# EAGLE design main (EAGLE 9.0.1)
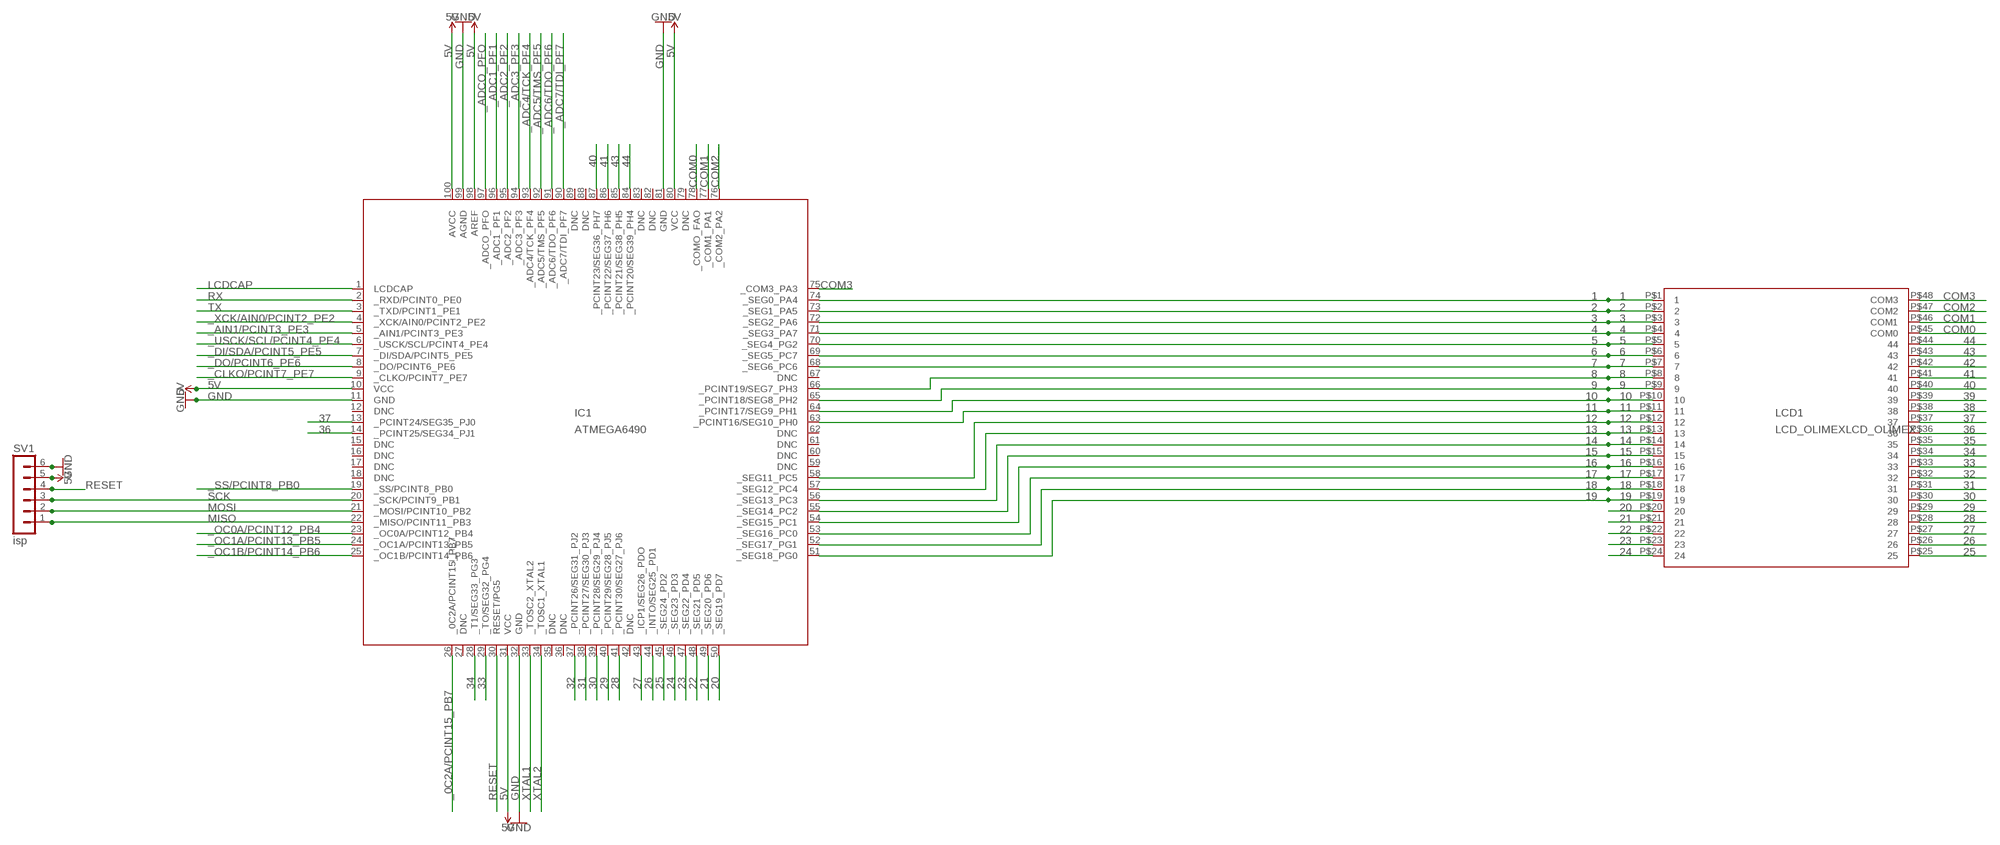
[diagram p0: schematic, sheet 1]

## Parts
IC1  ATMEGA6490  [TQFP100]
LCD1  LCD_OLIMEXLCD_OLIMEX  [LCD_OLIMEX]
SV1  isp  MA06-1  [MA06-1]

## Nets
1: IC1.74(_SEG0_PA4) LCD1.P$1
2: IC1.73(_SEG1_PA5) LCD1.P$2
3: IC1.72(_SEG2_PA6) LCD1.P$3
4: IC1.71(_SEG3_PA7) LCD1.P$4
5: IC1.70(_SEG4_PG2) LCD1.P$5
5V: IC1.10(VCC) IC1.31(VCC) IC1.80(VCC) IC1.98(AREF) IC1.100(AVCC) SV1.5
6: IC1.69(_SEG5_PC7) LCD1.P$6
7: IC1.68(_SEG6_PC6) LCD1.P$7
8: IC1.66(_PCINT19/SEG7_PH3) LCD1.P$8
9: IC1.65(_PCINT18/SEG8_PH2) LCD1.P$9
10: IC1.64(_PCINT17/SEG9_PH1) LCD1.P$10
11: IC1.63(_PCINT16/SEG10_PH0) LCD1.P$11
12: IC1.58(_SEG11_PC5) LCD1.P$12
13: IC1.57(_SEG12_PC4) LCD1.P$13
14: IC1.56(_SEG13_PC3) LCD1.P$14
15: IC1.55(_SEG14_PC2) LCD1.P$15
16: IC1.54(_SEG15_PC1) LCD1.P$16
17: IC1.53(_SEG16_PC0) LCD1.P$17
18: IC1.52(_SEG17_PG1) LCD1.P$18
19: IC1.51(_SEG18_PG0) LCD1.P$19
20: IC1.50(_SEG19_PD7) LCD1.P$20
21: IC1.49(_SEG20_PD6) LCD1.P$21
22: IC1.48(_SEG21_PD5) LCD1.P$22
23: IC1.47(_SEG22_PD4) LCD1.P$23
24: IC1.46(_SEG23_PD3) LCD1.P$24
25: IC1.45(_SEG24_PD2) LCD1.P$25
26: IC1.44(_INTO/SEG25_PD1) LCD1.P$26
27: IC1.43(_ICP1/SEG26_PDO) LCD1.P$27
28: IC1.41(_PCINT30/SEG27_PJ6) LCD1.P$28
29: IC1.40(_PCINT29/SEG28_PJ5) LCD1.P$29
30: IC1.39(_PCINT28/SEG29_PJ4) LCD1.P$30
31: IC1.38(_PCINT27/SEG30_PJ3) LCD1.P$31
32: IC1.37(_PCINT26/SEG31_PJ2) LCD1.P$32
33: IC1.29(_TO/SEG32_PG4) LCD1.P$33
34: IC1.28(_T1/SEG33_PG3) LCD1.P$34
35: LCD1.P$35
36: IC1.14(_PCINT25/SEG34_PJ1) LCD1.P$36
37: IC1.13(_PCINT24/SEG35_PJ0) LCD1.P$37
38: LCD1.P$38
39: LCD1.P$39
40: IC1.87(_PCINT23/SEG36_PH7) LCD1.P$40
41: IC1.86(_PCINT22/SEG37_PH6) LCD1.P$41
42: LCD1.P$42
43: IC1.85(_PCINT21/SEG38_PH5) LCD1.P$43
44: IC1.84(_PCINT20/SEG39_PH4) LCD1.P$44
_0C2A/PCINT15_PB7: IC1.26(_0C2A/PCINT15_PB7)
_ADC1_PF1: IC1.96(_ADC1_PF1)
_ADC2_PF2: IC1.95(_ADC2_PF2)
_ADC3_PF3: IC1.94(_ADC3_PF3)
_ADC4/TCK_PF4: IC1.93(_ADC4/TCK_PF4)
_ADC5/TMS_PF5: IC1.92(_ADC5/TMS_PF5)
_ADC6/TDO_PF6: IC1.91(_ADC6/TDO_PF6)
_ADC7/TDI_PF7: IC1.90(_ADC7/TDI_PF7)
_ADCO_PFO: IC1.97(_ADCO_PFO)
_AIN1/PCINT3_PE3: IC1.5(_AIN1/PCINT3_PE3)
_CLKO/PCINT7_PE7: IC1.9(_CLKO/PCINT7_PE7)
_DI/SDA/PCINT5_PE5: IC1.7(_DI/SDA/PCINT5_PE5)
_DO/PCINT6_PE6: IC1.8(_DO/PCINT6_PE6)
_OC0A/PCINT12_PB4: IC1.23(_OC0A/PCINT12_PB4)
_OC1A/PCINT13_PB5: IC1.24(_OC1A/PCINT13_PB5)
_OC1B/PCINT14_PB6: IC1.25(_OC1B/PCINT14_PB6)
_SS/PCINT8_PB0: IC1.19(_SS/PCINT8_PB0)
_USCK/SCL/PCINT4_PE4: IC1.6(_USCK/SCL/PCINT4_PE4)
_XCK/AIN0/PCINT2_PE2: IC1.4(_XCK/AIN0/PCINT2_PE2)
COM0: IC1.78(_COMO_FAO) LCD1.P$45(COM0)
COM1: IC1.77(_COM1_PA1) LCD1.P$46(COM1)
COM2: IC1.76(_COM2_PA2) LCD1.P$47(COM2)
COM3: IC1.75(_COM3_PA3) LCD1.P$48(COM3)
GND: IC1.11(GND) IC1.32(GND) IC1.81(GND) IC1.99(AGND) SV1.6
LCDCAP: IC1.1(LCDCAP)
MISO: IC1.22(_MISO/PCINT11_PB3) SV1.1
MOSI: IC1.21(_MOSI/PCINT10_PB2) SV1.2
RESET: IC1.30(RESET/PG5) SV1.4
RX: IC1.2(_RXD/PCINT0_PE0)
SCK: IC1.20(_SCK/PCINT9_PB1) SV1.3
TX: IC1.3(_TXD/PCINT1_PE1)
XTAL1: IC1.33(_TOSC2_XTAL2)
XTAL2: IC1.34(_TOSC1_XTAL1)
Unconnected: IC1.12(DNC) IC1.15(DNC) IC1.16(DNC) IC1.17(DNC) IC1.18(DNC) IC1.27(DNC) IC1.35(DNC) IC1.36(DNC) IC1.42(DNC) IC1.59(DNC) IC1.60(DNC) IC1.61(DNC) IC1.62(DNC) IC1.67(DNC) IC1.79(DNC) IC1.82(DNC) IC1.83(DNC) IC1.88(DNC) IC1.89(DNC)

## Library data of the parts
IC1 = 7_segment_lib:ATMEGA6490: temp edit this description Auto generated by make-symbol-device-package-bsdl.ulp Rev. 44 Source: temp.txt
LCD1 = 7_segment_lib:LCD_OLIMEX: Untitled 1 edit this description Auto generated by make-symbol-device-package-bsdl.ulp Rev. 44 Source: Untitled 1.txt
SV1 = con-lstb:MA06-1: PIN HEADER; OC_FARNELL: unknown; OC_NEWARK: unknown

## Board
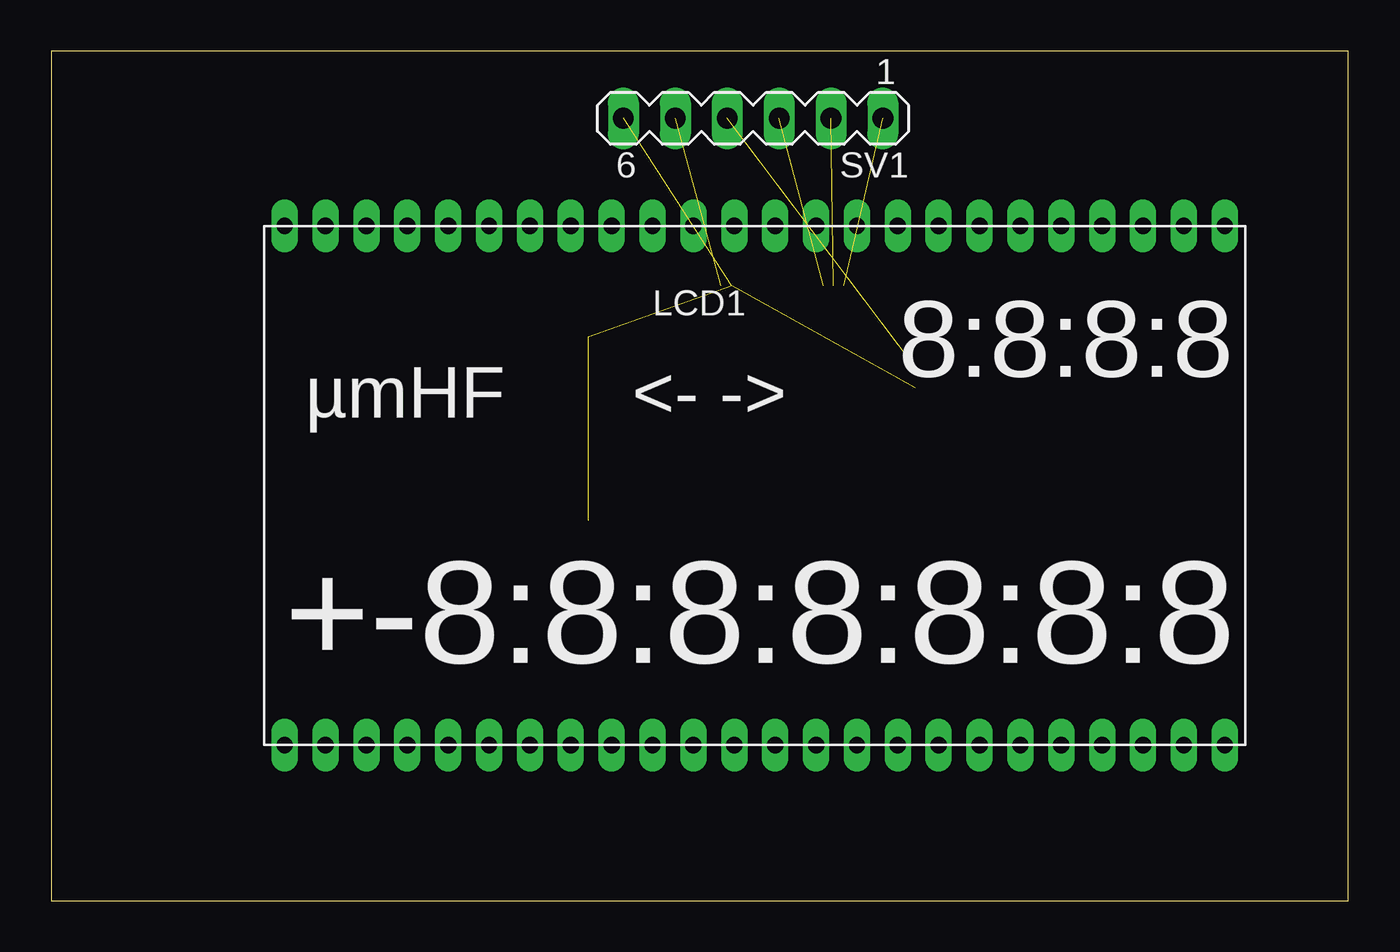
[diagram p1: board, top side]
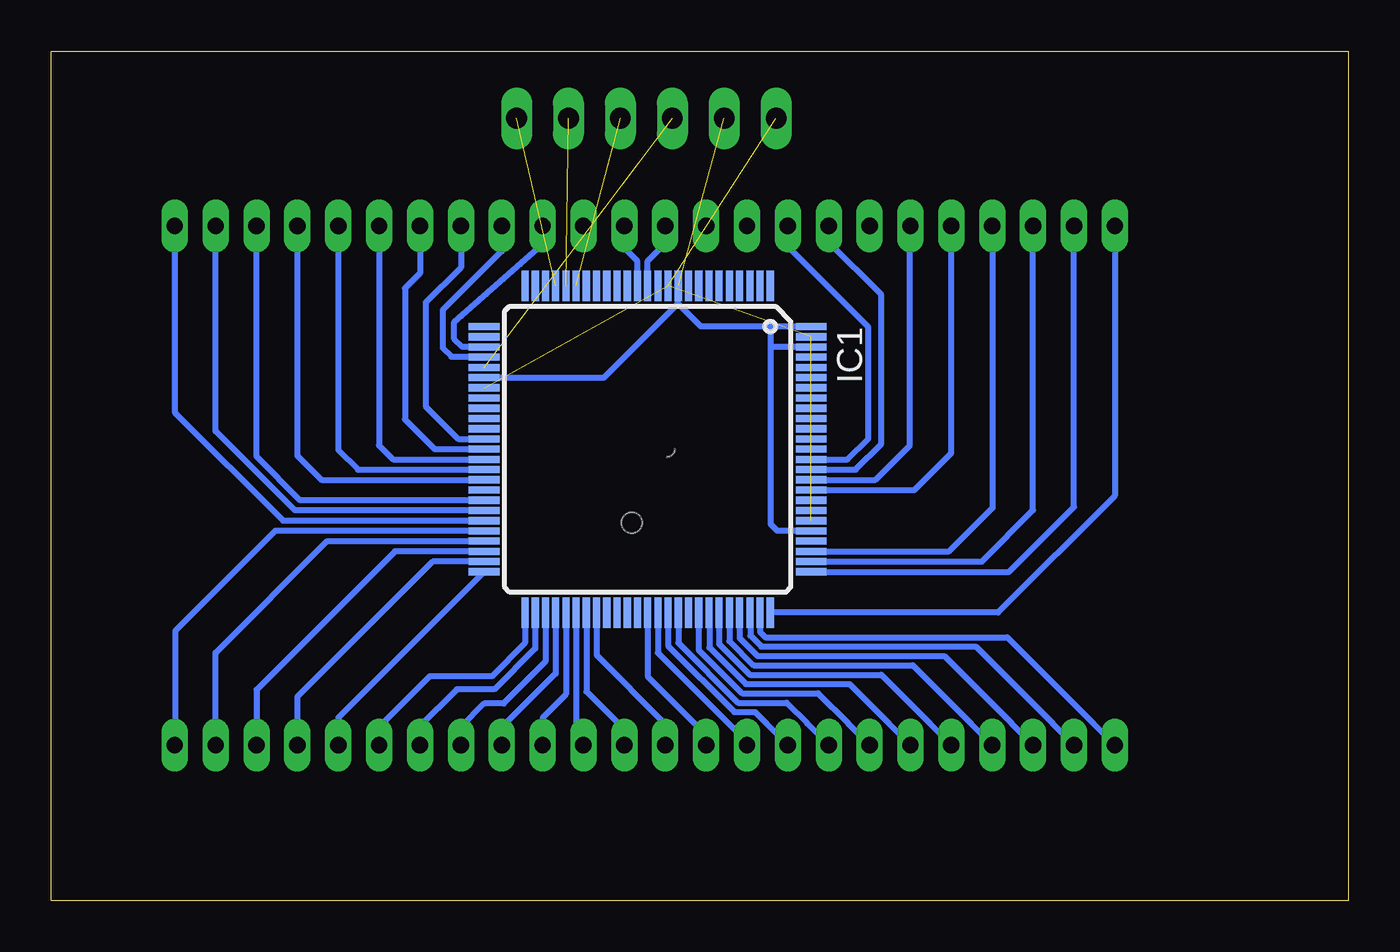
[diagram p2: board, bottom side, seen from below]

Size 63.48 x 41.58 mm. Coordinates in mm from the lower left corner, seen from the top.
Outline: 0,0 63.48,0 63.48,41.58 0,41.58 0,0
Copper layers (1*16): Top 0.035mm / dielectric 1.5mm / Bottom 0.035mm
Design rules "default": minimum track width 6mil, minimum drill 0.35mm, track to track 6mil, track to pad 6mil, pad to pad 6mil, via to via 6mil, smd to smd 6mil, copper to edge 40mil, drill to drill 6mil, minimum pad ring 10mil, minimum via ring 8mil, stop-mask expansion 4mil, vias tented up to drill 0mil, thermal gap 10mil

### Footprints (pad centres in the part's own frame; a part is rotated, then mirrored left to right if it is on the bottom)
TQFP100 = smd 1.5 x 0.35: 1 -8,6; 2 -8,5.5; 3 -8,5; 4 -8,4.5; 5 -8,4; 6 -8,3.5; 7 -8,3; 8 -8,2.5; 9 -8,2; 10 -8,1.5; 11 -8,1; 12 -8,0.5; 13 -8,0; 14 -8,-0.5; 15 -8,-1; 16 -8,-1.5; 17 -8,-2; 18 -8,-2.5; 19 -8,-3; 20 -8,-3.5; 21 -8,-4; 22 -8,-4.5; 23 -8,-5; 24 -8,-5.5; 25 -8,-6; 51 8,-6; 52 8,-5.5; 53 8,-5; 54 8,-4.5; 55 8,-4; 56 8,-3.5; 57 8,-3; 58 8,-2.5; 59 8,-2; 60 8,-1.5; 61 8,-1; 62 8,-0.5; 63 8,0; 64 8,0.5; 65 8,1; 66 8,1.5; 67 8,2; 68 8,2.5; 69 8,3; 70 8,3.5; 71 8,4; 72 8,4.5; 73 8,5; 74 8,5.5; 75 8,6 | smd 0.35 x 1.5: 26 -6,-8; 27 -5.5,-8; 28 -5,-8; 29 -4.5,-8; 30 -4,-8; 31 -3.5,-8; 32 -3,-8; 33 -2.5,-8; 34 -2,-8; 35 -1.5,-8; 36 -1,-8; 37 -0.5,-8; 38 0,-8; 39 0.5,-8; 40 1,-8; 41 1.5,-8; 42 2,-8; 43 2.5,-8; 44 3,-8; 45 3.5,-8; 46 4,-8; 47 4.5,-8; 48 5,-8; 49 5.5,-8; 50 6,-8; 76 6,8; 77 5.5,8; 78 5,8; 79 4.5,8; 80 4,8; 81 3.5,8; 82 3,8; 83 2.5,8; 84 2,8; 85 1.5,8; 86 1,8; 87 0.5,8; 88 0,8; 89 -0.5,8; 90 -1,8; 91 -1.5,8; 92 -2,8; 93 -2.5,8; 94 -3,8; 95 -3.5,8; 96 -4,8; 97 -4.5,8; 98 -5,8; 99 -5.5,8; 100 -6,8
LCD_OLIMEX = drill 0.8 long: P$1 0,0; P$2 2,0; P$3 4,0; P$4 6,0; P$5 8,0; P$6 10,0; P$7 12,0; P$8 14,0; P$9 16,0; P$10 18,0; P$11 20,0; P$12 22,0; P$13 24,0; P$14 26,0; P$15 28,0; P$16 30,0; P$17 32,0; P$18 34,0; P$19 36,0; P$20 38,0; P$21 40,0; P$22 42,0; P$23 44,0; P$24 46,0; P$25 46,25.4; P$26 44,25.4; P$27 42,25.4; P$28 40,25.4; P$29 38,25.4; P$30 36,25.4; P$31 34,25.4; P$32 32,25.4; P$33 30,25.4; P$34 28,25.4; P$35 26,25.4; P$36 24,25.4; P$37 22,25.4; P$38 20,25.4; P$39 18,25.4; P$40 16,25.4; P$41 14,25.4; P$42 12,25.4; P$43 10,25.4; P$44 8,25.4; P$45 6,25.4; P$46 4,25.4; P$47 2,25.4; P$48 0,25.4
MA06-1 = drill 1.016 long: 1 -6.35,0; 2 -3.81,0; 3 -1.27,0; 4 1.27,0; 5 3.81,0; 6 6.35,0

### Placement (x,y rotation side)
IC1  34.29,22.1 270 bottom
LCD1  11.43,7.62 0 top
SV1  34.35,38.29 180 top

### Tracks (layer width: path | path; a pad name or v marks a point on that pad's centre or on a via)
1
  Bottom 0.305: IC1.74 28.79,13.15 28.53,12.89 16.69,12.89 12.47,8.67 12.47,8.66 LCD1.P$1
2
  Bottom 0.305: IC1.73 29.27,14.08 29.27,12.98 28.72,12.43 18.23,12.43 14.47,8.67 14.47,8.66 LCD1.P$2
3
  Bottom 0.305: LCD1.P$3 16.47,8.66 16.47,8.67 19.78,11.98 28.91,11.98 29.79,12.85 IC1.72
4
  Bottom 0.305: LCD1.P$4 18.47,8.66 18.47,8.67 21.32,11.52 29.1,11.52 30.29,12.71 IC1.71
5
  Bottom 0.305: LCD1.P$5 20.47,8.66 20.47,8.67 22.86,11.06 29.29,11.06 30.79,12.56 IC1.70
5V  (1 unrouted)
  Bottom 0.305: 32.81,29.22 32.81,30.08 IC1.10 | IC1.31 36.43,25.6 32.81,29.22 | IC1.100 28,28.1 28.39,28.1 | 28.39,28.1 31.69,28.1 32.81,29.22 | IC1.80 27.94,18.1 28.26,18.41 28.26,27.11 | 28.26,27.11 28.26,27.97 28.39,28.1 | 28.26,27.11 28.24,27.1 IC1.98
6
  Bottom 0.305: LCD1.P$6 22.47,8.66 22.47,8.67 24.4,10.6 29.48,10.6 31.27,12.39 31.27,14.08 IC1.69
7
  Bottom 0.305: LCD1.P$7 24.47,8.66 24.47,8.67 25.95,10.15 29.67,10.15 31.79,12.27 IC1.68
8
  Bottom 0.305: LCD1.P$8 26.47,8.66 26.47,8.67 27.49,9.69 29.86,9.69 32.79,12.62 IC1.66
9
  Bottom 0.305: LCD1.P$9 28.47,8.66 28.47,8.67 29.03,9.23 30.05,9.23 33.29,12.47 IC1.65
10
  Bottom 0.305: IC1.64 33.79,12.13 29.43,7.77 LCD1.P$10
11
  Bottom 0.305: IC1.63 34.29,10.98 31.43,8.12 LCD1.P$11
12
  Bottom 0.305: IC1.58 36.79,12.02 33.43,8.66 LCD1.P$12
13
  Bottom 0.305: IC1.57 37.29,10.24 35.43,8.38 LCD1.P$13
14
  Bottom 0.305: IC1.56 37.79,7.98 LCD1.P$14
15
  Bottom 0.305: IC1.55 38.29,10.1 39.43,8.96 LCD1.P$15
16
  Bottom 0.305: IC1.54 38.79,11.12 41.43,8.48 LCD1.P$16
17
  Bottom 0.305: IC1.53 39.29,11.7 41.34,9.65 42.29,9.65 43.43,8.51 LCD1.P$17
18
  Bottom 0.305: IC1.52 39.79,12.34 41.78,10.35 43.62,10.35 45.47,8.51 45.47,7.66 LCD1.P$18
19
  Bottom 0.305: IC1.51 40.29,12.6 41.91,10.98 44.96,10.98 47.44,8.51 47.43,8.5 LCD1.P$19
20
  Bottom 0.305: IC1.50 49.43,8.96 LCD1.P$20
21
  Bottom 0.305: LCD1.P$21 51.43,9.97 44.81,16.6 IC1.49
22
  Bottom 0.305: IC1.48 46.66,17.1 53.43,10.32 LCD1.P$22
23
  Bottom 0.305: IC1.47 49.97,17.6 55.43,12.13 LCD1.P$23
24
  Bottom 0.305: IC1.46 52.51,18.1 57.4,13.21 57.4,7.65 LCD1.P$24
25
  Bottom 0.305: IC1.45 52.13,18.6 57.43,23.9 LCD1.P$25
26
  Bottom 0.305: LCD1.P$26 55.43,22.98 51.55,19.1 IC1.44
27
  Bottom 0.305: LCD1.P$27 53.43,21.74 51.28,19.6 IC1.43
28
  Bottom 0.305: LCD1.P$28 51.43,21.78 50.25,20.6 IC1.41
29
  Bottom 0.305: IC1.40 48.47,21.1 49.43,22.06 LCD1.P$29
30
  Bottom 0.305: IC1.39 46.74,21.6 47.43,22.28 LCD1.P$30
31
  Bottom 0.305: IC1.38 44.7,22.1 46.16,23.56 46.16,29.97 45.43,30.71 LCD1.P$31
32
  Bottom 0.305: IC1.37 43.55,22.6 45.15,24.19 45.15,29.27 43.43,30.99 LCD1.P$32
33
  Bottom 0.305: IC1.29 42.31,26.62 43.89,26.62 44.32,27.05 44.32,28.89 41.43,31.78 LCD1.P$33
34
  Bottom 0.305: IC1.28 43.35,27.1 43.75,27.5 43.75,28.32 39.43,32.13 LCD1.P$34
36
  Bottom 0.305: IC1.14 34.79,31.3 35.43,31.94 LCD1.P$36
37
  Bottom 0.305: IC1.13 34.29,31.31 33.47,32.13 33.47,32.99 LCD1.P$37
40
  Bottom 0.305: IC1.87 24.5,21.6 23.5,22.61 23.5,28.07 27.43,32 27.43,32.01 LCD1.P$40
41
  Bottom 0.305: IC1.86 24.11,21.1 22.86,22.35 22.86,29.65 25.46,32.26 25.46,32.99 LCD1.P$41
43
  Bottom 0.305: IC1.85 23.15,20.6 21.46,22.29 21.46,32.99 LCD1.P$43
44
  Bottom 0.305: IC1.84 21.24,20.1 19.43,21.91 LCD1.P$44
COM0
  Bottom 0.305: IC1.78 19.54,17.1 17.4,19.24 17.4,32.99 LCD1.P$45
COM1
  Bottom 0.305: IC1.77 17.95,16.6 15.43,19.11 LCD1.P$46
COM2
  Bottom 0.305: IC1.76 16.61,16.1 13.43,19.27 LCD1.P$47
COM3
  Bottom 0.305: IC1.75 17.14,14.1 11.43,19.81 LCD1.P$48
GND  (4 unrouted)
MISO  (1 unrouted)
MOSI  (1 unrouted)
RESET  (1 unrouted)
SCK  (1 unrouted)